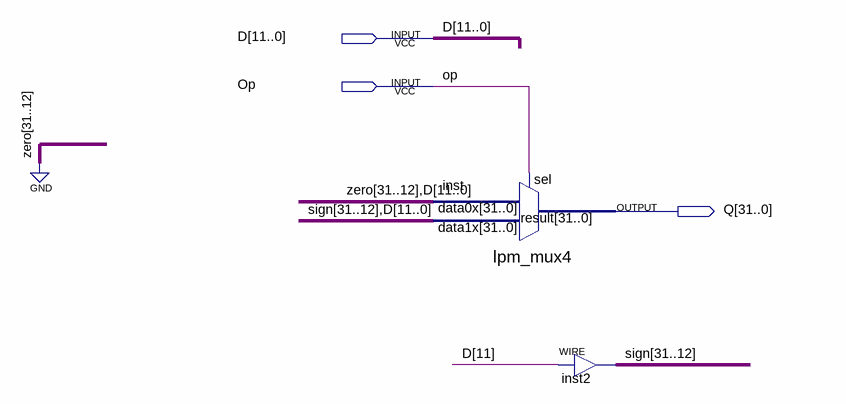
[diagram p0: schematic sheet]
// Quartus schematic ExtU.bdf as structural Verilog: 2 symbols, 3 pins
module ExtU (
  input  [11:0] D,
  input  Op,
  output [31:0] Q
);

  wire [31:12] sign;

  lpm_mux4 inst (.data1x({sign, D}), .data0x({{20{1'b0}}, D}), .sel(Op), .result(Q));
  assign sign = {20{D[11]}};  // WIRE inst2
endmodule
